# EAGLE board ARM_board (EAGLE 6.5.0), part 1 of 2
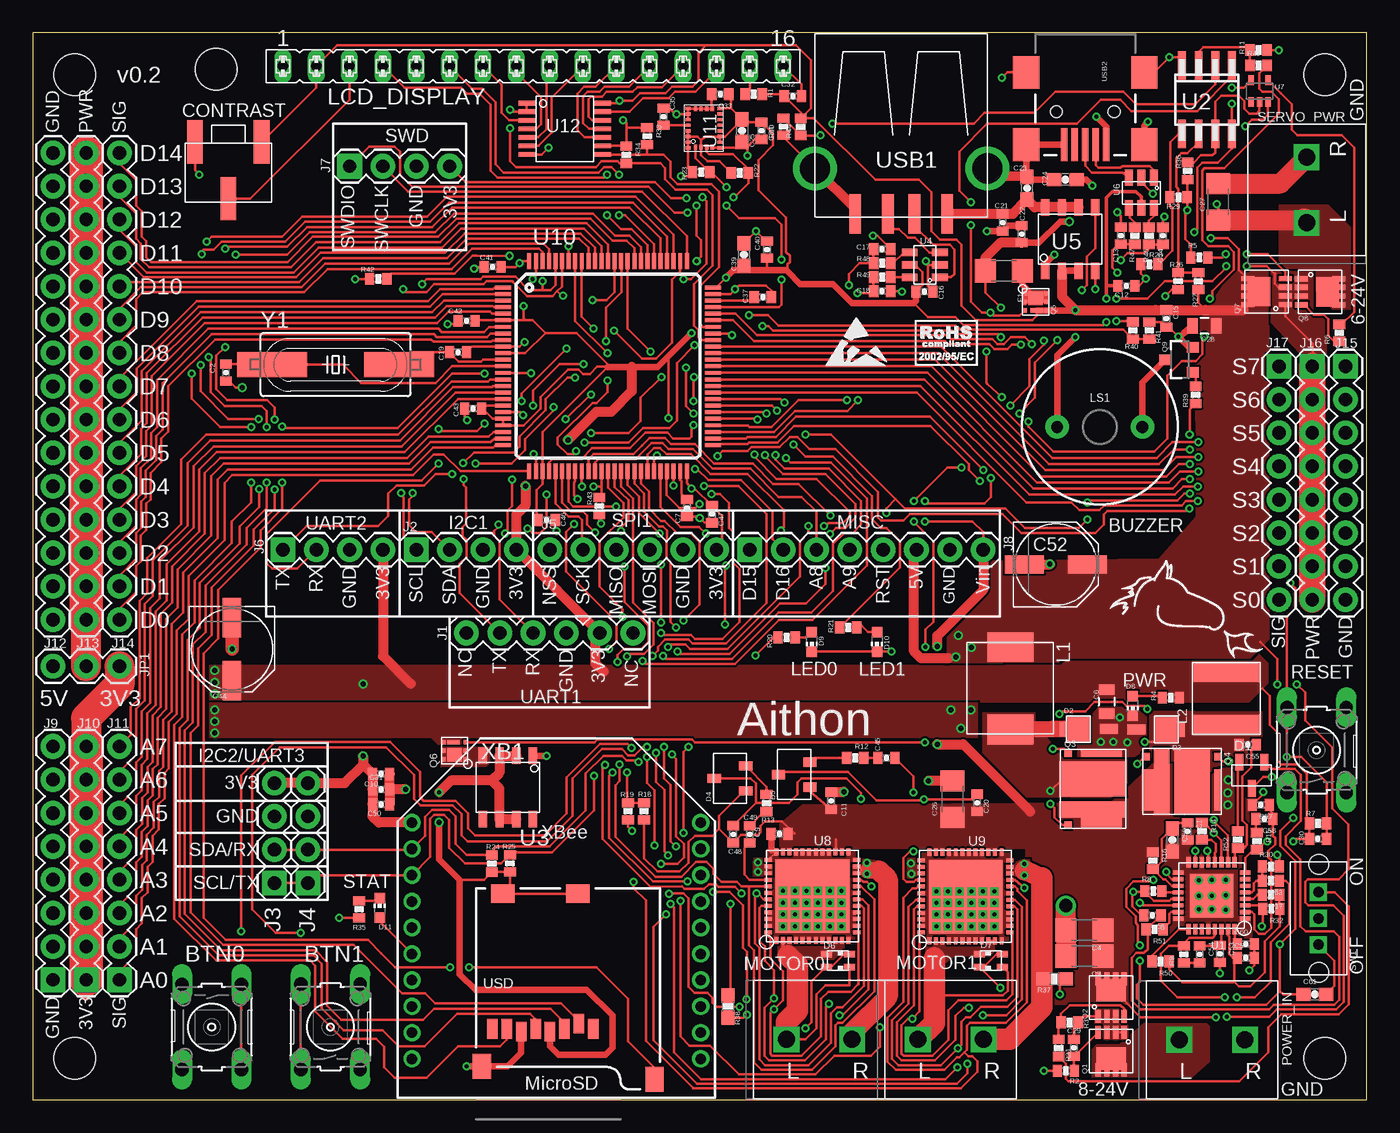
[diagram p1: board, top side]
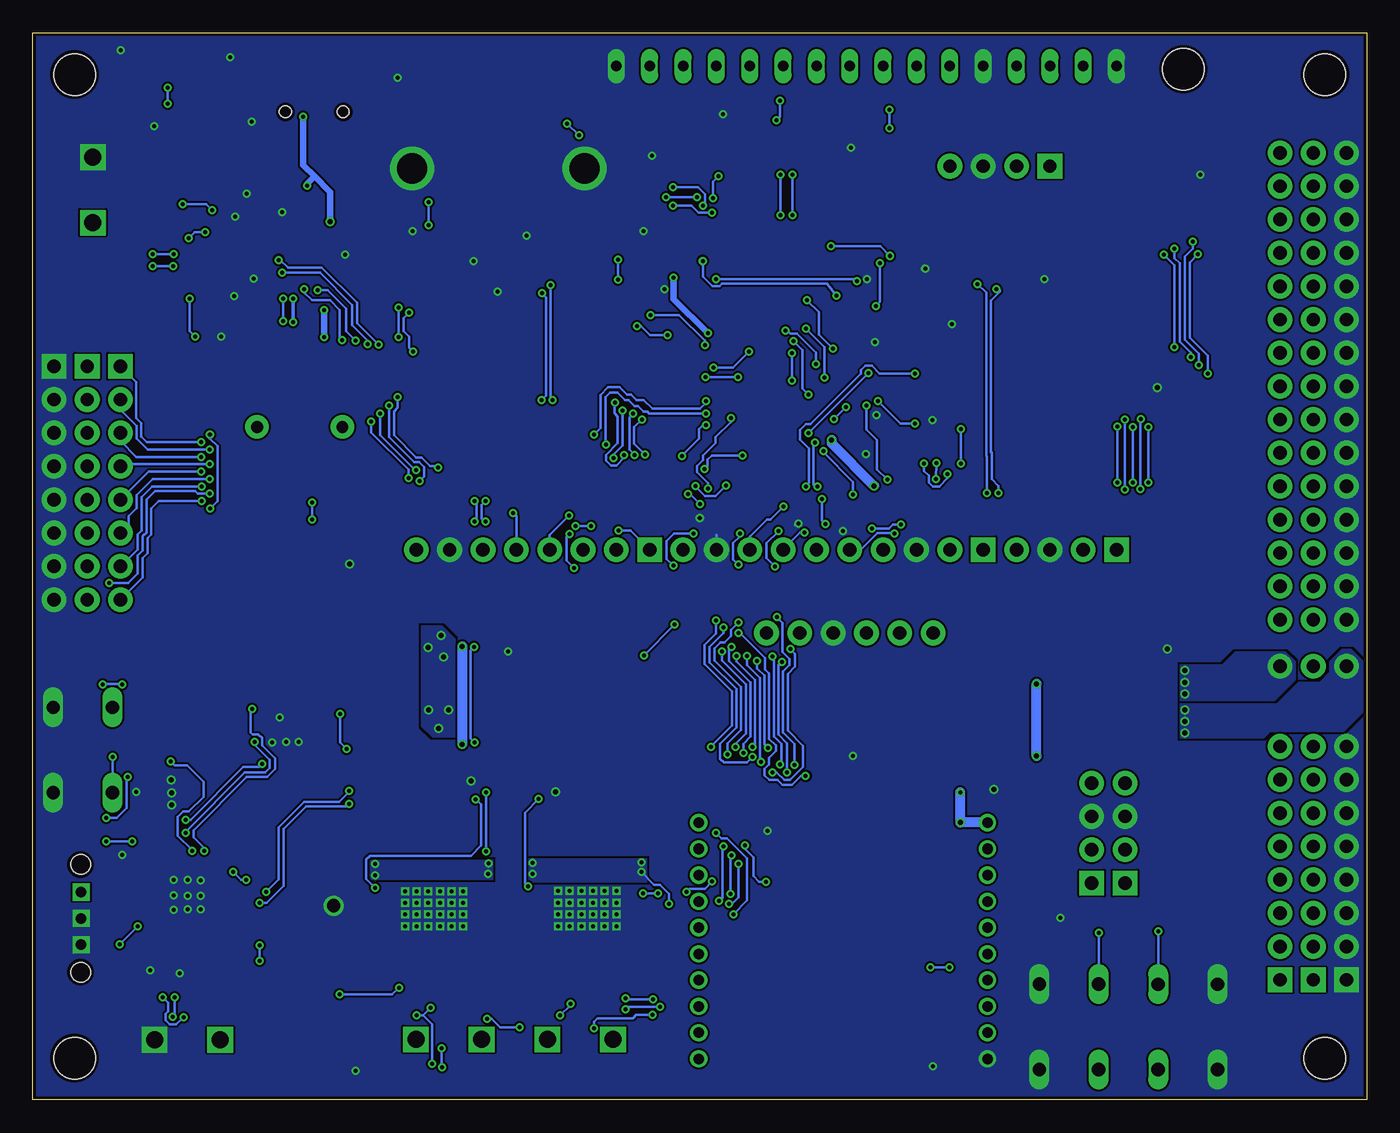
[diagram p2: board, bottom side, seen from below]

Size 101.6 x 81.28 mm. Coordinates in mm from the lower left corner, seen from the top.
Outline: 0,0 101.6,0 101.6,81.28 0,81.28 0,0
Copper layers (1*16): Top 0.035mm / dielectric 1.5mm / Bottom 0.035mm
Design rules "Fusion_eagle_rule_v1.1": minimum track width 6mil, minimum drill 12mil, track to track 6mil, track to pad 6mil, pad to pad 6mil, via to via 6mil, smd to smd 0mil, copper to edge 10mil, drill to drill 10mil, minimum pad ring 10mil, minimum via ring 6mil, stop-mask expansion 2mil, vias tented up to drill 100mil, thermal gap 10mil
Holes 3.17 mm at 98.42,78.11 98.42,3.17 3.17,3.17 13.97,78.51 3.17,78.11
tRestrict: area 95.2,74.9 to 101.6,81.3; area 95.2,0 to 101.6,6.3; area 0,0 to 6.3,6.3; area 10.8,75.3 to 17.1,81.6; area 0,74.9 to 6.3,81.3
vRestrict: area 11.4,45 to 91.4,81.1; 8 lines

## Footprints (pad centres in the part's own frame; a part is rotated, then mirrored left to right if it is on the bottom)
B3F-10XX = drill 1.016 long: 1 -3.251,2.261; 2 3.251,2.261; 3 -3.251,-2.261; 4 3.251,-2.261
0402-CAP = smd 0.7 x 0.9: 1 -0.65,0; 2 0.65,0
1206 = smd 1.6 x 1.8: 1 -1.4,0; 2 1.4,0
0805 = smd 0.8 x 1.2: 1 -0.9,0; 2 0.9,0
0603-CAP = smd 1.1 x 1: 1 -0.85,0; 2 0.85,0
PANASONIC_D = smd 3 x 1.4: + 2.4,0; - -2.4,0
SOT-23 = smd 0.61 x 1.26: P$0 0,-0.995; P$1 0.95,0.995; P$2 -0.95,0.995
STPS1L30M = smd 0.5 x 1.1: C2 -2.07,0 | smd 1.38 x 0.75: P$1 1.397,0 | smd 1.82 x 2.03: P$2 -0.91,0
SOT-23' = smd 0.7 x 1: 1 -0.95,-1.2; 2 0.95,-1.2; 3 0,1.2
LED-0606 = smd 0.85 x 0.5: 1 0.875,0.5; 2 -0.875,0.5; 3 0.875,-0.5; 4 -0.875,-0.5
CHIP-LED0603 = smd 0.8 x 0.8: A 0,-0.75; C 0,0.75
1X06 = drill 1.016 pad 1.88: 1 0,0; 2 2.54,0; 3 5.08,0; 4 7.62,0; 5 10.16,0; 6 12.7,0
1X04 = drill 1.016 pad 1.88 square: 1 0,0 | drill 1.016 pad 1.88: 2 2.54,0; 3 5.08,0; 4 7.62,0
1X08 = drill 1.016 pad 1.88 square: 1 0,0 | drill 1.016 pad 1.88: 2 2.54,0; 3 5.08,0; 4 7.62,0; 5 10.16,0; 6 12.7,0; 7 15.24,0; 8 17.78,0
1X15 = drill 1.016 pad 1.88: 1 0,0; 2 2.54,0; 3 5.08,0; 4 7.62,0; 5 10.16,0; 6 12.7,0; 7 15.24,0; 8 17.78,0; 9 20.32,0; 10 22.86,0; 11 25.4,0; 12 27.94,0; 13 30.48,0; 14 33.02,0; 15 35.56,0
1X03 = drill 1.016 pad 1.88: 1 0,0; 2 2.54,0; 3 5.08,0
INDUCTOR-LMIP707 = smd 2.261 x 3.505: P$1 3.124,0; P$2 -3.124,0
INDUCTOR-0520CDMCDS = smd 1.5 x 5.2: P$1 -2,0; P$2 2,0
LCD = drill 0.8 long: A 16.51,0; DB0 -3.81,0; DB1 -1.27,0; DB2 1.27,0; DB3 3.81,0; DB4 6.35,0; DB5 8.89,0; DB6 11.43,0; DB7 13.97,0; E -6.35,0; K 19.05,0; R/W -8.89,0; RS -11.43,0; VDD -16.51,0; VO -13.97,0; VSS -19.05,0
BUZZER-12MM = drill 0.9 pad 1.778: + 3.25,0; - -3.25,0
2POS_TERMINAL = drill 1.3 square: L -5,0; R 0,0
POT = smd 1.194 x 3.302: 1 -2.54,0; 2 0,4.318; 3 2.54,0
POWERPAK1212-8 = smd 0.991 x 0.406: 1 -1.435,0.991; 2 -1.435,0.33; 3 -1.435,-0.33; 4 -1.435,-0.991; 5 1.435,0.991; 6 1.435,0.33; 7 1.435,-0.33; 8 1.435,-0.991 | smd 1.727 x 2.235: PAD 0.559,0
DUAL-MOSFET-STL60N32N3LL = smd 0.57 x 0.6: 1 -1.905,-2.151; 8 -1.905,3.35 | smd 3.11 x 0.9: 2/3/4 0.635,-2 | smd 3.11 x 0.6: 5/6/7 0.635,3.35 | smd 5.1 x 1.2: D1 0,-0.95 | smd 5.1 x 2.69: S1D2 0,1.37
POWERFLAT = smd 0.35 x 0.3: 1 -0.65,-0.825; 2 0,-0.825; 3 0.65,-0.825; 4 0.65,0.825; 5 0,0.825; 6 -0.65,0.825 | smd 0.35 x 0.95: 7 0.65,0.087 | smd 1.05 x 1.125: 8 -0.3,0
SOT23-3 = smd 0.8 x 0.9: 1 -0.95,-1; 2 0.95,-1; 3 0,1.1
0402-RES = smd 0.7 x 0.9: 1 -0.65,0; 2 0.65,0
0603-RES = smd 1.1 x 1: 1 -0.85,0; 2 0.85,0
SW = drill 0.8 square: P$1 0,0; P$2 2,0; P$3 -2,0 | hole 1.5: -4.1,-0.04; 4.1,-0.04
VFQFPN-32 = smd 0.8 x 0.32: 1 -2.55,1.75; 2 -2.55,1.25; 3 -2.55,0.75; 4 -2.55,0.25; 5 -2.55,-0.25; 6 -2.55,-0.75; 7 -2.55,-1.25; 8 -2.55,-1.75; 17 2.55,-1.75; 18 2.55,-1.25; 19 2.55,-0.75; 20 2.55,-0.25; 21 2.55,0.25; 22 2.55,0.75; 23 2.55,1.25; 24 2.55,1.75 | smd 0.32 x 0.8: 9 -1.75,-2.55; 10 -1.25,-2.55; 11 -0.75,-2.55; 12 -0.25,-2.55; 13 0.25,-2.55; 14 0.75,-2.55; 15 1.25,-2.55; 16 1.75,-2.55; 25 1.75,2.55; 26 1.25,2.55; 27 0.75,2.55; 28 0.25,2.55; 29 -0.25,2.55; 30 -0.75,2.55; 31 -1.25,2.55; 32 -1.75,2.55 | smd 3.3 x 3.3: PAD 0,0
SO08 = smd 0.6 x 2.2: 1 -1.905,-2.6; 2 -0.635,-2.6; 3 0.635,-2.6; 4 1.905,-2.6; 5 1.905,2.6; 6 0.635,2.6; 7 -0.635,2.6; 8 -1.905,2.6
8-SOIC = smd 0.635 x 1.27: 1 -1.27,-1.778; 2 0,-1.778; 3 1.27,-1.778; 4 2.54,-1.778; 5 2.54,3.048; 6 1.27,3.048; 7 0,3.048; 8 -1.27,3.048
SOT23-6L = smd 1.2 x 0.6: P$1 -1.1,0.9; P$2 -1.1,-0.05; P$3 -1.1,-1; P$4 1.2,-1; P$5 1.2,-0.05; P$6 1.2,0.9
SC70 = smd 0.4 x 0.75: 1 -0.65,-0.825; 2 0,-0.825; 3 0.65,-0.825; 4 0.65,0.825; 5 -0.65,0.825
VFQFPN48 = smd 0.55 x 0.3: 1 -3.375,2.75; 2 -3.375,2.25; 3 -3.375,1.75; 4 -3.375,1.25; 5 -3.375,0.75; 6 -3.375,0.25; 7 -3.375,-0.25; 8 -3.375,-0.75; 9 -3.375,-1.25; 10 -3.375,-1.75; 11 -3.375,-2.25; 12 -3.375,-2.75; 25 3.375,-2.75; 26 3.375,-2.25; 27 3.375,-1.75; 28 3.375,-1.25; 29 3.375,-0.75; 30 3.375,-0.25; 31 3.375,0.25; 32 3.375,0.75; 33 3.375,1.25; 34 3.375,1.75; 35 3.375,2.25; 36 3.375,2.75 | smd 0.3 x 0.55: 13 -2.75,-3.375; 14 -2.25,-3.375; 15 -1.75,-3.375; 16 -1.25,-3.375; 17 -0.75,-3.375; 18 -0.25,-3.375; 19 0.25,-3.375; 20 0.75,-3.375; 21 1.25,-3.375; 22 1.75,-3.375; 23 2.25,-3.375; 24 2.75,-3.375; 37 2.75,3.375; 38 2.25,3.375; 39 1.75,3.375; 40 1.25,3.375; 41 0.75,3.375; 42 0.25,3.375; 43 -0.25,3.375; 44 -0.75,3.375; 45 -1.25,3.375; 46 -1.75,3.375; 47 -2.25,3.375; 48 -2.75,3.375 | smd 5.6 x 5.6: PAD 0,0
TQFP100 = smd 1.2 x 0.3: 1 -8,6; 2 -8,5.5; 3 -8,5; 4 -8,4.5; 5 -8,4; 6 -8,3.5; 7 -8,3; 8 -8,2.5; 9 -8,2; 10 -8,1.5; 11 -8,1; 12 -8,0.5; 13 -8,0; 14 -8,-0.5; 15 -8,-1; 16 -8,-1.5; 17 -8,-2; 18 -8,-2.5; 19 -8,-3; 20 -8,-3.5; 21 -8,-4; 22 -8,-4.5; 23 -8,-5; 24 -8,-5.5; 25 -8,-6; 51 8,-6; 52 8,-5.5; 53 8,-5; 54 8,-4.5; 55 8,-4; 56 8,-3.5; 57 8,-3; 58 8,-2.5; 59 8,-2; 60 8,-1.5; 61 8,-1; 62 8,-0.5; 63 8,0; 64 8,0.5; 65 8,1; 66 8,1.5; 67 8,2; 68 8,2.5; 69 8,3; 70 8,3.5; 71 8,4; 72 8,4.5; 73 8,5; 74 8,5.5; 75 8,6 | smd 0.3 x 1.2: 26 -6,-8; 27 -5.5,-8; 28 -5,-8; 29 -4.5,-8; 30 -4,-8; 31 -3.5,-8; 32 -3,-8; 33 -2.5,-8; 34 -2,-8; 35 -1.5,-8; 36 -1,-8; 37 -0.5,-8; 38 0,-8; 39 0.5,-8; 40 1,-8; 41 1.5,-8; 42 2,-8; 43 2.5,-8; 44 3,-8; 45 3.5,-8; 46 4,-8; 47 4.5,-8; 48 5,-8; 49 5.5,-8; 50 6,-8; 76 6,8; 77 5.5,8; 78 5,8; 79 4.5,8; 80 4,8; 81 3.5,8; 82 3,8; 83 2.5,8; 84 2,8; 85 1.5,8; 86 1,8; 87 0.5,8; 88 0,8; 89 -0.5,8; 90 -1,8; 91 -1.5,8; 92 -2,8; 93 -2.5,8; 94 -3,8; 95 -3.5,8; 96 -4,8; 97 -4.5,8; 98 -5,8; 99 -5.5,8; 100 -6,8
LSM330 = smd 0.25 x 0.375: 1 -1.505,1.212; 6 -1.505,-1.212; 7 -1.075,-1.212; 8 -0.645,-1.212; 9 -0.215,-1.212; 10 0.215,-1.212; 11 0.645,-1.212; 12 1.075,-1.212; 13 1.505,-1.212; 18 1.505,1.212; 19 1.075,1.212; 20 0.645,1.212; 21 0.215,1.212; 22 -0.215,1.212; 23 -0.645,1.212; 24 -1.075,1.212 | smd 0.375 x 0.25: 2 -1.462,0.645; 3 -1.462,0.215; 4 -1.462,-0.215; 5 -1.462,-0.645; 14 1.462,-0.645; 15 1.462,-0.215; 16 1.462,0.215; 17 1.462,0.645
TSSOP-14 = smd 1.26 x 0.36: 1 -2.9,1.95; 2 -2.9,1.3; 3 -2.9,0.65; 4 -2.9,0; 5 -2.9,-0.65; 6 -2.9,-1.3; 7 -2.9,-1.95; 8 2.9,-1.95; 9 2.9,-1.3; 10 2.9,-0.65; 11 2.9,0; 12 2.9,0.65; 13 2.9,1.3; 14 2.9,1.95
USB-A-S = smd 3 x 0.9: D+ 3.45,-1; D- 3.45,1; GND 3.45,-3.5; VBUS 3.45,3.5 | drill 2.311: GND@1 0,6.566; GND@2 0,-6.566
USB-MINIB = smd 2.5 x 0.5: D+ 2.5,0; D- 2.5,0.8; GND 2.5,-1.6; ID 2.5,-0.8; VBUS 2.5,1.6 | smd 2.5 x 2: MTN1 -3,4.5; MTN2 2.5,4.5; MTN3 -3,-4.5; MTN4 2.5,-4.5 | hole 0.9: 0,2.2; 0,-2.2
MICRO-SD-SOCKET-PP = smd 0.8 x 1.5: 1 -8.94,10.7; 2 -7.84,10.3; 3 -6.74,10.7; 4 -5.64,10.9; 5 -4.54,10.7; 6 -3.44,10.9; 7 -2.34,10.7; 8 -1.24,10.7 | smd 1.8 x 1.4: CD1 -2.05,0.4; CD2 -7.75,0.4 | smd 1.4 x 1.9: GND1 -13.6,14.55; GND3 -0.45,13.55
XBEE = drill 0.8 pad 1.27: 1 -11,9; 2 -11,7; 3 -11,5; 4 -11,3; 5 -11,1; 6 -11,-1; 7 -11,-3; 8 -11,-5; 9 -11,-7; 10 -11,-9; 11 11,-9; 12 11,-7; 13 11,-5; 14 11,-3; 15 11,-1; 16 11,1; 17 11,3; 18 11,5; 19 11,7; 20 11,9
HC49UP = smd 5.334 x 1.93: 1 -4.826,0; 2 4.826,0

## Placement (x,y rotation side)
BTN0  [B3F-10XX]  13.62,5.55 270 top
BTN1  [B3F-10XX]  22.67,5.55 90 top
C1  0.1u  [0402-CAP]  87.96,20.45 270 top
C2  20p  [0402-CAP]  14.71,55.4 270 top
C3  33u  [1206]  80.1,10.94 180 top
C4  33u  [1206]  80.1,12.92 180 top
C5  1u  [0402-CAP]  92.4,10.81 0 top
C6  33u  [0805]  81.79,30.33 270 top
C7  2.2u  [0402-CAP]  49.83,45.09 270 top
C8  0.1u  [0402-CAP]  85.29,14.06 180 top
C9  0.1u  [0402-CAP]  56.86,20.26 180 top
C10  1u  [0402-CAP]  26.53,24.82 0 top
C11  0.1u  [0402-CAP]  60.81,22.78 90 top
C12  0.1u  [0402-CAP]  83.3,62 0 top
C13  47p  [0402-CAP]  82.88,65.84 90 top
C14  47p  [0402-CAP]  86.08,65.81 90 top
C15  0.1u  [0402-CAP]  86.35,59.52 270 top
C16  0.1u  [0402-CAP]  67.92,61.57 0 top
C17  47p  [0402-CAP]  64.69,64.8 0 top
C18  47p  [0402-CAP]  64.69,61.6 0 top
C19  20p  [0402-CAP]  32.38,56.95 0 top
C20  .22u  [0402-CAP]  71.93,22.63 90 top
C21  0.1u  [0402-CAP]  73.87,66.83 270 top
C22  0.1u  [0402-CAP]  75.31,65.95 270 top
C23  10u  [0603-CAP]  75.73,69.45 90 top
C24  10u  [0603-CAP]  78.65,70.1 0 top
C25  10u  [0603-CAP]  54.03,73.83 270 top
C26  33u  [1206]  70.04,22.9 90 top
C27  33u  [1206]  90.29,68.4 90 top
C28  33u  [0805]  89.24,58.96 180 top
C29  0.1u  [0402-CAP]  79.3,3.96 270 top
C30  10n  [0402-CAP]  97.89,19.89 0 top
C31  0.1u  [0402-CAP]  26.53,23.65 0 top
C32  0.1u  [0402-CAP]  57.89,76.45 0 top
C33  0.1u  [0402-CAP]  52.36,76.6 180 top
C34  0.1u  [0402-CAP]  55.51,73.81 270 top
C35  10n  [0402-CAP]  48.03,74.89 90 top
C37  2.2u  [0402-CAP]  55.6,61.14 0 top
C39  4.7u  [0603-CAP]  54.17,64.38 90 top
C40  0.1u  [0402-CAP]  55.93,64.77 90 top
C41  0.1u  [0402-CAP]  35.03,63.45 180 top
C42  0.1u  [0402-CAP]  33.05,59.33 180 top
C43  0.1u  [0402-CAP]  33.53,52.65 180 top
C44  470u  [PANASONIC_D]  15.17,34.32 270 top
C45  10n  [0402-CAP]  65.02,26.05 0 top
C46  1u  [0402-CAP]  39.14,44.17 0 top
C47  10n  [0402-CAP]  51.74,44.61 270 top
C48  .22u  [0402-CAP]  53.35,20.23 90 top
C49  10n  [0402-CAP]  54.61,20.22 270 top
C50  20p  [0402-CAP]  26.53,22.51 0 top
C52  470u  [PANASONIC_D]  77.92,40.78 0 top
C53  47p  [0402-CAP]  90.42,11.12 270 top
C54  100p  [0402-CAP]  88.87,11.08 270 top
C55  0.1u  [0402-CAP]  92.53,27.05 180 top
C57  47p  [0402-CAP]  93.54,22.46 180 top
C58  100p  [0402-CAP]  93.8,21.4 180 top
C59  4.7u  [0603-CAP]  86.79,19.79 270 top
C60  0.1u  [0402-CAP]  92.4,11.87 0 top
C61  4.7u  [0603-CAP]  97.65,8.03 0 top
D1  BAS70-06FILM  [SOT-23]  92.85,24.72 0 top
D2  STPS1L30M  [STPS1L30M]  80.56,28.24 0 top
D3  STPS1L30M  [STPS1L30M]  85.45,28.2 180 top
D4  BAS70-05FILM  [SOT-23']  53.11,24.49 90 top
D5  BAV99  [SOT-23']  58.01,24.77 90 top
D6  RED/GRN  [LED-0606]  61.32,10.62 180 top
D7  RED/GRN  [LED-0606]  72.97,10.62 0 top
D8  RED  [CHIP-LED0603]  83.78,30 180 top
D9  YELLOW  [CHIP-LED0603]  59.33,34.89 180 top
D10  YELLOW  [CHIP-LED0603]  64.3,34.89 180 top
D11  YELLOW  [CHIP-LED0603]  26.42,14.62 0 top
F1  1A  [1206]  73.97,63.15 180 top
J1  Bluesmirf  [1X06]  33.02,35.56 0 top
J2  I2C1  [1X04]  29.21,41.91 0 top
J3  I2C2/USART3  [1X04]  18.4,16.51 90 top
J4  I2C2/USART3  [1X04]  20.94,16.51 90 top
J5  SPI  [1X06]  52.07,41.91 180 top
J6  USART2  [1X04]  19.05,41.91 0 top
J7  SWD  [1X04]  24.13,71.12 0 top
J8  MISC  [1X08]  54.61,41.91 0 top
J9  AGND  [1X08]  1.52,9.14 90 top
J10  APWR  [1X08]  4.06,9.14 90 top
J11  ANALOG  [1X08]  6.6,9.14 90 top
J12  DGND  [1X15]  1.52,36.58 90 top
J13  DPWR  [1X15]  4.06,36.58 90 top
J14  DIGITAL  [1X15]  6.6,36.58 90 top
J15  SGND  [1X08]  100,55.88 270 top
J16  SPWR  [1X08]  97.46,55.88 270 top
J17  SERVO  [1X08]  94.92,55.88 270 top
JP1  DPWR_SEL  [1X03]  6.6,33.02 180 top
L1  1.5uH  [INDUCTOR-LMIP707]  74.45,31.34 270 top
L2  3.3uH  [INDUCTOR-0520CDMCDS]  90.91,30.58 90 top
LCD  LCD_DISPLAY  [LCD]  38.1,78.74 0 top
LS1  BUZZERPTH  [BUZZER-12MM]  81.27,51.26 180 top
MOTOR0  2POS_TERMINAL  [2POS_TERMINAL]  62.41,4.6 0 top
MOTOR1  2POS_TERMINAL  [2POS_TERMINAL]  72.42,4.6 0 top
POT  10K  [POT]  14.9,72.96 180 top
POWER  2POS_TERMINAL  [2POS_TERMINAL]  92.33,4.57 0 top
Q1  SI7617  [POWERPAK1212-8]  82.14,3.71 270 top
Q2  SI7617  [POWERPAK1212-8]  82.14,7.8 90 top
Q3  DUAL-MOSFET  [DUAL-MOSFET-STL60N32N3LL]  80.75,23.08 0 top
Q4  DUAL-MOSFET  [DUAL-MOSFET-STL60N32N3LL]  86.93,24.25 270 top
Q5  STL4P2UH7  [POWERFLAT]  76.38,60.78 270 top
Q6  STL4P2UH7  [POWERFLAT]  32.13,26.59 90 top
Q7  SI7617  [POWERPAK1212-8]  93.97,61.57 180 top
Q8  SI7617  [POWERPAK1212-8]  98.06,61.56 0 top
Q9  2STR1230  [SOT23-3]  87.37,56.38 90 top
R1  10  [0402-RES]  54.91,76.61 0 top
R2  100k  [0402-RES]  78.69,2.21 180 top
R3  100k  [0402-RES]  78.97,5.89 0 top
R4  220  [0402-RES]  86.68,30.64 0 top
R5  100k  [0402-RES]  88.85,64.16 0 top
R6  100k  [0402-RES]  99.51,58.43 90 top
R7  10k  [0402-RES]  97.89,21.06 180 top
R8  510  [0402-RES]  85.35,15.9 0 top
R9  1k  [0402-RES]  87.67,11.09 90 top
R10  10k  [0402-RES]  57.18,74.12 90 top
R11  10k  [0402-RES]  93.37,79.97 180 top
R12  100  [0402-RES]  62.64,26.05 180 top
R13  100  [0402-RES]  55.89,22.61 90 top
R14  220  [0402-RES]  89.05,20.47 270 top
R15  1k  [0402-RES]  93.24,19.71 270 top
R16  3.9  [0402-RES]  85.31,18.22 270 top
R17  100k  [0402-RES]  94.31,15.62 180 top
R18  93.1k  [0402-RES]  46.56,21.98 90 top
R19  10k  [0402-RES]  45.34,21.98 270 top
R20  220  [0402-RES]  57.42,35.22 180 top
R21  220  [0402-RES]  62.11,35.98 180 top
R22  4.7k  [0402-RES]  53.85,70.61 180 top
R23  4.7k  [0402-RES]  50.91,70.66 180 top
R24  4.7k  [0402-RES]  34.96,18 270 top
R25  4.7k  [0402-RES]  36.34,18.01 270 top
R26  10k  [0402-RES]  87.23,62.36 90 top
R27  39k  [0402-RES]  88.77,62.36 270 top
R28  10k  [0402-RES]  85.05,63.65 180 top
R29  39k  [0402-RES]  87.26,68.75 180 top
R30  100k  [0402-RES]  94.3,17.77 0 top
R31  10k  [0402-RES]  78.13,3.95 270 top
R32  47  [0402-RES]  94.34,14.55 180 top
R33  1k  [0402-RES]  46.79,73.41 270 top
R34  1k  [0402-RES]  45.21,71.98 270 top
R35  220  [0402-RES]  24.85,14.52 90 top
R36  100k  [0402-RES]  87.96,70.75 270 top
R37  3k  [0603-RES]  77.83,9.21 0 top
R38  3k  [0603-RES]  52.96,7.11 270 top
R39  10k  [0402-RES]  88.57,53.7 90 top
R40  93.1k  [0402-RES]  83.79,58.61 270 top
R41  10k  [0402-RES]  85.04,58.6 90 top
R42  10k  [0402-RES]  26.31,62.53 0 top
R43  10k  [0402-RES]  43.15,45.23 90 top
R44  39k  [0402-RES]  58.5,74.11 90 top
R45  39k  [0402-RES]  93.36,78.8 0 top
R46  15  [0402-RES]  85.01,65.81 270 top
R47  15  [0402-RES]  83.95,65.81 270 top
R48  15  [0402-RES]  64.69,63.73 180 top
R49  15  [0402-RES]  64.69,62.67 180 top
R50  100k  [0402-RES]  85.9,10.54 180 top
R51  10  [0402-RES]  85.45,12.99 180 top
R52  10  [0402-RES]  91.78,19.82 90 top
R53  330k  [0402-RES]  94.3,16.69 180 top
RESET  [B3F-10XX]  97.79,26.64 90 top
SERVO_PWR  2POS_TERMINAL  [2POS_TERMINAL]  97.03,71.81 90 top
SW1  SW  [SW]  97.92,13.82 90 top
U1  PM6685  [VFQFPN-32]  89.79,15.55 180 top
U2  LM358DT  [SO08]  89.43,76.17 180 top
U3  LD1117D33TR  [8-SOIC]  36.82,24.43 180 top
U4  USBLC6-2  [SOT23-6L]  68,63.55 180 top
U5  STMPS2171MTR  [8-SOIC]  78.38,64.94 0 top
U6  USBLC6-2  [SOT23-6L]  84.48,69.14 270 top
U7  NC7SZU04  [SC70]  93.43,76.83 0 top
U8  L6206Q  [VFQFPN48]  59.39,15.52 90 top
U9  L6206Q  [VFQFPN48]  71.04,15.49 90 top
U10  STM32F437VI  [TQFP100]  43.81,55.88 0 top
U11  LSM330  [LSM330]  51.12,74.02 90 top
U12  MC74HC164  [TSSOP-14]  40.51,73.96 0 top
USB1  USB-A-S  [USB-A-S]  66.14,70.94 270 top
USB2  USB-MINIB-5PIN  [USB-MINIB]  80.16,75.26 270 top
USD  USD-SOCKETNEW  [MICRO-SD-SOCKET-PP]  33.76,16.1 180 top
XB1  XBEE  [XBEE]  39.88,12.12 0 top
Y1  8MHz  [HC49UP]  23.06,56.01 0 top

## Tracks (layer width: path | path; a pad name or v marks a point on that pad's centre or on a via)
5V  (via drill 0.3, 0.38)
  Top 0.203: Q7.8 Q7.7 93.2,62.43 93.2,61.77 Q7.PAD | 92.41,62.43 Q7.8 | POT.1 21.59,77.11 LCD.VDD 23.19,80.34 51.28,80.34 | R27.2 88.77,60.73 89.33,60.17 | Q7.8 91.87,63.22 91.87,64.8 91.03,65.65 v89.71,65.65 | v88.48,66.08 88.69,66.29 88.69,71.01 89.08,71.4 90.27,71.4 91.34,72.46 U2.8 91.34,74.03 v91.34,75.87 | v91.34,77.11 92.24,77.11 U7.5 | R1.2 57.08,76.61 C32.1 58.5,75.19 R44.2 58.52,74.79 | 51.28,80.34 58.12,80.34 59.28,79.18 59.28,75.54 58.52,74.79 | 58.52,74.79 59.48,74.79 64.17,70.1 67.49,70.1 68.45,69.14 68.45,66.17 69.09,65.53 70.34,65.53 70.73,65.14 70.73,60.49 71.83,59.39 76.13,59.39 76.47,59.73 Q5.7 | v90.93,6.31 94.19,6.31 94.77,6.88 99.3,6.88 99.87,7.46 99.87,14 99.06,14.81 97.15,14.81 96.93,15.04 96.93,16.59 97.13,16.79 99.46,16.79 100.22,17.55 100.22,20.97 98.98,22.2 98.98,26.83 96.93,28.89 96.93,31.01 v96.28,31.66 | C15.1 85.51,60.17 85.5,60.17 | U1.29 90.04,12.53 89.86,12.35 88.08,12.35 87.67,11.94 R9.2 86.53,11.74 85.92,11.12 85.92,9.05 87.17,7.8 v90.79,7.8 | v94.79,31.66 94.79,33.57 93.5,34.87 | U12.14 44.49,75.92 v44.7,76.12 45.68,76.12 46.24,76.68 48.21,76.68 48.7,77.17 50.23,77.17 50.7,77.64 50.7,79.76 51.28,80.34 | 45.21,74.08 R34.1 45.17,72.67 U12.9 | 45.21,74.08 45.21,74.38 v44.96,74.62 | R33.1 45.23,74.06 45.21,74.08
  Top 0.254: Q7.7 Q7.6 Q7.5
  Top 0.508: U5.2 U5.3 | LS1.+ 78.03,56.52 78.03,56.73 v79.41,58.11 | Q5.7 Q5.4 79.36,60.13 v79.4,60.17
  Top 0.762: U5.2 78.38,61.19 v79.4,60.17 85.5,60.17 89.33,60.17 92.23,60.17 | 69.75,33.63 67.66,33.63 67.13,34.16 67.13,41.73 J8.6
  Bottom 0.203: v88.48,66.08 89.28,66.08 v89.71,65.65 | v91.34,77.11 v91.34,75.87 | v91.34,75.87 | v90.79,7.8 90.79,6.45 v90.93,6.31 | v94.79,31.66 94.82,31.68 96.26,31.68 v96.28,31.66 | v44.7,76.12 44.7,74.88 v44.96,74.62
  Bottom 0.508: v79.4,60.17 v79.41,58.11
  other vias: 13.84,29.72 13.84,28.83 13.84,27.94 69.91,29.7 71.47,29.71 70.69,28.31 71.49,34.46 70.3,33.74 70.48,35.37
  pour Top (rank 3, no thermals): 94.16,63.2 94.16,35.08 92.71,33.63 78.41,33.63 78.12,33.31 69.66,33.25 69.67,34.09 69.67,37.47 73.18,41.1 85.8,41.25 88.62,44.45 88.57,58.9 91.44,63.22 94.13,63.22
  pour Top (rank 4, no thermals): 29.48,28.37 32.68,28.36 32.89,27.5 32.59,27.03 31.02,27.03 30.92,27.03 30.4,27.54
  pour Top (rank 4): 13.47,30.26 71.96,30.26 71.96,27.56 13.47,27.56
  pour Bottom (rank 4, no thermals): 14.22,30.25 14.22,27.57 7.84,27.57 7.33,28.07 1.75,28.07 0.25,29.57 0.25,33.39 1.17,34.31 1.89,34.31 2.84,33.36 2.84,32.55 3.58,31.81 7.53,31.81 9.09,30.25
  pour Bottom (rank 4, no thermals): 69.42,27.61 71.12,27.61 71.97,28.46 71.97,36.13 70.47,36.13 69.44,35.1 69.42,35.08
+3V3  (via drill 0.3, 0.38)
  Top 0.203: U4.P$5 67.21,63.6 67.77,63.04 67.77,62.07 C16.1 | 37.52,59.38 U10.6 33.74,59.38 C42.1 | U10.100 37.19,63.88 v37.06,63.75 36.75,63.45 C41.1 | v37.39,60.48 37.39,59.51 37.52,59.38 | U10.75 52.02,61.88 v52.78,62.64 | U10.50 49.81,47 v50.16,46.58 50.38,46.58 C47.1 52.5,44.47 52.5,42.34 J5.1 | 53.87,63.22 54.08,63.42 54.08,63.43 C39.1 | 55.96,63.22 55.93,63.25 C40.1 | U10.19 34.4,52.88 34.24,52.72 34.24,52.65 | 34.24,52.65 35.01,51.88 U10.21 U10.22 37.38,51.38 38.67,52.67 38.67,53.54 40.76,55.63 41.58,55.63 41.9,55.3 42.42,55.3 42.98,55.85 43.79,55.85 43.76,55.83 38.81,50.88 U10.28 38.81,46.89 38.38,46.46 38.38,44.28 C46.1 | U10.11 37.51,56.88 39.04,58.41 | 39.04,58.41 41.41,58.41 43.81,56.01 43.81,55.83 | v48.44,51.94 48.44,56.67 v50.16,58.39 | 91.22,32.26 L2.P$2 | C43.1 34.24,52.65 | 92.39,17.3 U1.8 92.34,18.43 92.95,19.03 R15.2 93.91,19.68 v94.04,19.68 | 57.49,63.11 57.49,63.65 57.66,63.82 57.66,64.31 57.38,64.58 57.38,67.18 55.26,69.31 55.26,71.6 56.37,72.71 56.37,73.6 C34.1 54.24,74.46 C25.1 | U11.7 U11.8 | 50.9,73.09 50.61,73.38 U11.23 | U11.8 51.19,73.38 50.9,73.09 | v81.79,59.26 81.55,59.02 70.89,59.02 70.27,59.64 68.19,59.64 67.12,60.71 | R22.2 52.32,71.49 51.37,71.49 50.9,71.96 U11.3 50.9,73.09 | U11.8 52.73,73.38 C25.1 | 37.52,59.38 38.07,59.38 39.04,58.41 | v96.01,19.69 96.21,19.89 C30.1 R7.2 97.05,21.25 97.05,24.82 96.32,25.55 95.08,25.55 94.78,25.85 94.78,27.97 94.21,28.54 94.21,30.77 93.64,31.33 | U11.23 U11.22 | U11.1 U11.24 U11.23 | U11.1 49.94,72.52 49.96,72.5 | U11.13 53.17,75.53 | 53.17,75.53 C25.1 | v49.38,70.34 49.94,70.34 R23.2 49.91,71.02 U11.1 | J7.4 32.97,69.9 47.4,69.9 48.6,68.7 v49.8,68.7
  Top 0.203: 53.17,75.53 53.17,76.44 C33.1 | USD.CD2 USD.CD1 36.34,16.24 R25.2 34.98,17.36 R24.2 34.36,16.74 32.52,16.74
  Top 0.254: 81.79,62.01 81.79,68.73 82.25,69.19 84.02,69.19 84.43,68.78 U6.P$5 | 81.79,62.01 v81.79,61.04 | 81.79,62.01 82.63,62.01 C12.1
  Top 0.508: v52.78,62.64 53.37,63.22 53.87,63.22 55.96,63.22 57.38,63.22 57.49,63.11 58.45,62.15 60.96,62.15 62.41,60.71 67.12,60.71 67.27,60.85 C16.1 | 43.76,55.83 43.81,55.83 45.62,55.83 47.6,55.83 v50.16,58.39 | USD.4 39.4,4.07 40.04,3.43 43.61,3.43 44.15,3.96 44.15,6.43 42.19,8.38 33.72,8.38 32.52,9.58 32.52,16.74 30.96,18.31 v30.96,21.12
  Top 0.762: J10.1 4.06,7.95 | J6.4 26.67,33.81 28.79,31.69 | J3.4 J4.4 23.75,24.13 25.15,25.52 25.15,25.56 | 45.62,55.83 45.62,53.97 44.04,52.4 42.9,52.4 v40.77,50.27 | v37.52,46.76 37.52,45.26 36.83,44.58 J2.4 J1.5 42.83,35.21 42.83,33.26 43.49,32.59 | U3.7 U3.6 35.55,23.72 34.94,24.32 | U3.2 U3.3 35.55,24.92 35.54,24.92 34.94,24.32 | XB1.1 26.37,21.12 25.88,21.61 C50.1 C31.1 C10.1 25.15,25.56 | v25.15,26.19 25.15,25.56 | 34.94,24.32 31.84,24.32 v30.96,23.43
  Top 2.286: JP1.1 6.6,31.62 4.06,29.08 J10.8
  Top 2.54: J10.1 J10.2 J10.3 J10.4 J10.5 J10.6 J10.7 J10.8
  Bottom 0.203: v37.06,63.75 37.06,60.81 v37.39,60.48 | v48.44,51.94 48.44,51.64 49.61,50.47 49.61,50.03 50.55,49.09 50.55,48.75 51.01,48.3 51.01,47.82 50.16,46.97 v50.16,46.58 | v94.04,19.68 v96.01,19.68 v96.01,19.69 | v49.8,68.7 49.8,69.93 v49.38,70.34
  Bottom 0.254: v81.79,59.26 v81.79,61.04
  Bottom 0.508: v52.78,62.64 52.78,61.01 v50.16,58.39 | 6.6,33.01 JP1.1 | v30.95,21.12 v30.96,21.12
  Bottom 0.762: v40.77,50.27 40.77,50.01 v37.52,46.76 | XB1.1 v30.95,21.12 | v25.15,26.19 v25.15,31.69 | v30.96,21.12 v30.96,23.43
  other vias: 13.84,32.7 13.84,31.81 13.84,30.92
  pour Bottom (rank 3, no thermals): 6.19,34.13 10,34.13 11,33.13 14.22,33.13 14.22,30.43 7,30.43 5.4,32.03 5.4,33.34
  pour Top (rank 5, no thermals): 13.47,30.43 13.47,33.14 75.84,33.14 76.77,34.07 93.28,34.07 94.06,33.29 94.06,31.71 93.56,31.21 93.17,30.82 92.62,30.27 13.47,30.27
ANALOG0
  Top 0.203: J11.1 6.6,9.78 7.87,11.05 7.87,13.01 8.31,13.44 8.31,15.37 8.74,15.8 8.74,17.75 9.12,18.14 9.12,20.12 9.6,20.6 9.6,22.53 10.03,22.96 10.03,24.92 10.36,25.25 10.36,28.8 10.97,29.41 10.97,35.75 11.86,36.64 11.86,39.9 14.61,42.65 14.61,46.99 15.19,47.58 28.96,47.58 30.52,49.14 31.3,49.14 32.56,47.88 U10.26
ANALOG1
  Top 0.203: J11.2 6.6,12.32 7.87,13.59 7.87,15.52 8.33,15.98 8.33,17.91 8.66,18.24 8.66,20.19 9.22,20.75 9.22,22.68 9.63,23.09 9.63,25.07 9.93,25.38 9.93,28.96 10.57,29.59 10.57,36.24 11.46,37.13 11.46,40.16 14.1,42.8 14.1,47.24 14.86,48.01 28.8,48.01 30.48,49.68 35.05,49.68 35.25,49.88 U10.25
ANALOG2
  Top 0.203: J11.3 6.6,14.86 7.87,16.13 7.87,18.09 8.28,18.49 8.28,20.4 8.76,20.88 8.76,22.81 9.14,23.19 9.14,25.2 9.5,25.55 9.5,29.11 10.16,29.77 10.16,36.64 11.02,37.5 11.02,40.41 13.59,42.98 13.59,47.5 14.55,48.46 28.66,48.46 30.28,50.09 34.87,50.09 35.16,50.38 U10.24
ANALOG3
  Top 0.203: J11.4 6.6,17.4 7.87,18.67 7.87,20.57 8.33,21.03 8.33,23.01 8.74,23.42 8.74,25.35 9.12,25.73 9.12,29.29 9.75,29.92 9.75,37.02 10.62,37.88 10.62,40.64 13.11,43.13 13.11,47.75 14.26,48.91 28.51,48.91 30.13,50.52 34.72,50.52 35.08,50.88 U10.23
ANALOG4
  Top 0.203: J11.5 6.6,19.94 7.87,21.21 7.87,23.16 8.28,23.57 8.28,25.53 8.71,25.96 8.71,29.44 9.35,30.07 9.35,37.2 10.19,38.04 10.19,40.82 12.68,43.31 12.68,48.01 14,49.33 28.33,49.33 32.37,53.38 U10.18
ANALOG5
  Top 0.203: J11.6 6.6,22.48 7.87,23.75 7.87,25.7 8.31,26.14 8.31,29.59 8.94,30.23 8.94,37.47 9.68,38.21 9.68,41.05 12.24,43.61 12.24,48.26 13.76,49.77 28.11,49.77 32.21,53.88 U10.17
ANALOG6
  Top 0.203: J11.7 6.6,25.02 7.87,26.29 7.87,29.77 8.53,30.43 8.53,37.78 9.14,38.39 9.14,41.1 11.79,43.74 11.79,48.51 13.49,50.22 27.97,50.22 32.03,54.28 34.98,54.28 35.08,54.38 U10.16
ANALOG7
  Top 0.203: J11.8 7.47,27.79 7.47,29.92 8.13,30.58 8.13,38.02 8.72,38.61 8.72,41.29 11.3,43.87 11.3,48.77 13.21,50.67 27.84,50.67 31.89,54.72 34.68,54.72 34.84,54.88 U10.15
ANALOG8
  Top 0.203: U10.36 42.81,48.55 43.08,48.82 45.92,48.82 47.14,50.03 47.96,50.03 48.42,49.57 50.28,49.57 51.77,48.08 54.66,48.08 56.81,45.93 58.56,45.93 59.69,44.8 J8.3
ANALOG9  (via drill 0.3)
  Top 0.203: U10.35 42.31,48.79 42.72,49.2 45.77,49.2 46.41,49.84 46.41,49.85 46.97,50.41 48.14,50.41 48.61,49.94 50.42,49.94 51.88,48.48 54.84,48.48 56.39,46.93 58.33,46.93 v60.74,44.52
  Bottom 0.203: J8.4 62.23,43.03 v60.74,44.52
BAT_SENSE  (via drill 0.3)
  Top 0.203: v41.22,43.87 40.62,43.26 40.62,40.23 44.04,36.81 44.04,36.62 44.46,36.2 44.46,34.88 v43.9,34.33 | U10.33 41.31,47.12 41.22,47.03 41.22,46.03 v41.48,45.77 | R18.2 R19.1 45.27,22.7 v45.27,24.94
  Bottom 0.203: v41.22,43.87 41.48,44.13 v41.48,45.77 | v45.27,24.94 44.94,24.94 44.35,24.35 43.92,24.35 42.93,25.35 42.93,26.98 44.09,28.14 44.09,32.45 43.55,32.99 43.55,33.98 v43.9,34.33
BOOT1  (via drill 0.3)
  Top 0.203: U10.37 43.31,46.73 | 43.31,46.73 43.31,46.05 R43.2 | 43.31,46.73 v42.7,46.73 v42.7,46.74 | v34.41,55.32 31.95,55.32 27.79,51.16 19.14,51.16 v19,51.3 | v19,47.01 19,45.03 17.35,43.38 17.35,42.06 14.12,38.84 14.12,35.13 13.01,34.01 13.01,13.86 14.7,12.17 25.53,12.17 26.53,11.17 27.59,10.11 v31.8,10.11 | USD.GND1 47.36,2.43 45.34,4.45 45.34,7.7 42.93,10.11 v33.24,10.11
  Bottom 0.203: v42.7,46.74 42.7,46.81 42.49,47.02 42.49,49.61 43.18,50.29 43.18,51.03 42.72,51.49 42.37,51.49 38.53,55.32 38.53,55.58 38.19,55.92 37.7,55.92 37.1,55.32 v34.41,55.32 | v19,51.3 v19,47.01 | v33.24,10.11 v31.8,10.11
BOOT3
  Top 0.203: R52.2 91.78,25.59 D1.P$2
BTN0  (via drill 0.3)
  Top 0.203: U10.57 56.29,52.88 v56.68,52.49 | v57.36,48.9 57.73,48.53 60.8,48.53 63.54,45.79 63.54,40.71 59.38,36.54 56.82,36.54 53.49,33.22 46.62,33.22 v46.43,33.41 | v45.62,26.82 45.31,27.1 43.19,27.1 40.65,24.57 40.65,21.81 39,20.16 33.69,20.16 33.17,20.69 33.17,21.81 32.19,22.78 29.78,22.78 29.51,23.06 29.51,24.99 27.22,27.28 18.47,27.28 15.88,24.7 v15.88,12.84 | BTN0.2 BTN0.1
  Bottom 0.203: BTN0.1 15.88,11.37 v15.88,12.84 | v56.68,52.49 56.68,49.83 57.36,49.15 v57.36,48.9 | v45.62,26.82 45.87,27.07 45.87,32.31 46.43,32.87 v46.43,33.41
BTN1  (via drill 0.3)
  Top 0.203: U10.58 56.96,53.38 v57.24,53.1 | v56.55,49.12 56.55,48.77 57.26,48.07 60.63,48.07 63.09,45.61 63.09,43.82 62.45,43.18 61.8,43.18 60.95,42.33 60.95,38.77 59.32,37.13 56.8,37.13 53.24,33.57 48.23,33.57 v48,33.8 | v46.79,26.89 46.48,26.89 45.85,26.25 45.34,26.25 44.88,26.71 43.37,26.71 41.12,24.47 41.12,21.64 39.17,19.68 33.1,19.68 32.65,20.14 32.65,21.77 31.98,22.43 29.54,22.43 29.03,22.94 29.03,24.74 26.91,26.86 18.81,26.86 16.71,24.77 16.71,14.52 18.5,12.73 v20.41,12.73 | BTN1.1 BTN1.2
  Bottom 0.203: BTN1.2 v20.41,12.73 | v57.24,53.1 57.3,53.04 57.3,52.3 57.05,52.05 57.05,50.01 57.94,49.12 57.94,48.69 57.58,48.32 57.15,48.32 56.55,48.91 v56.55,49.12 | v46.79,26.89 46.58,27.1 46.58,31.98 48,33.4 v48,33.8
BUZZER  (via drill 0.3)
  Top 0.203: 88.38,53.05 R39.1 88.11,52.59 v88.11,50.67 | U10.29 39.34,47.9 39.34,48.56 39.6,48.82 41.78,48.82 42.6,49.63 45.5,49.63 46.68,50.81 48.33,50.81 48.77,50.38 50,50.38 50.16,50.53 50.16,51.21 v50.33,51.39 | v52.15,49.05 52.53,49.43 54.45,49.43 54.73,49.71 56.88,49.71 57.66,50.49 58.24,50.49 59.16,49.55 61.14,49.55 64.39,46.3 64.39,44.35 64.62,44.12 66.33,44.12 66.82,44.62 73.86,44.62 75.32,43.16 80.92,43.16 81.58,43.83 81.58,44.58 81.86,44.86 87.81,44.86 88.01,45.06 v88.1,45.06
  Bottom 0.203: v52.15,49.05 52.15,49.07 50.85,50.37 50.85,51.08 50.54,51.39 v50.33,51.39 | v88.11,50.67 88.11,50.37 87.53,49.78 87.53,45.63 v88.1,45.06
DIGITAL0
  Top 0.203: J14.1 6.6,37.41 7.87,38.68 7.87,40.66 8.23,41.02 8.23,43 8.64,43.41 8.64,45.41 8.97,45.74 8.97,47.75 9.78,48.56 9.78,50.37 10.31,50.9 10.31,54.36 13.88,57.93 30.34,57.93 30.52,57.74 34.91,57.74 35.01,57.85 35.79,57.85 U10.9
DIGITAL1
  Top 0.203: J14.2 6.6,39.95 7.87,41.22 7.87,43.18 8.26,43.56 8.26,45.57 8.61,45.92 8.61,47.93 9.4,48.72 9.4,50.57 9.88,51.05 9.88,54.59 13.63,58.33 30.56,58.33 30.77,58.12 34.61,58.12 34.85,58.36 35.8,58.36 U10.8
DIGITAL2
  Top 0.203: J14.3 6.6,42.49 7.87,43.76 7.87,45.74 8.23,46.1 8.23,48.11 9.02,48.9 9.02,50.8 9.47,51.26 9.47,54.84 13.37,58.73 30.91,58.73 31.15,58.49 34.37,58.49 34.76,58.88 U10.7
DIGITAL3
  Top 0.203: J14.4 6.6,45.03 7.87,46.3 7.87,48.26 8.64,49.02 8.64,50.93 9.07,51.36 9.07,55.12 13.11,59.16 30.79,59.16 31.67,60.05 34.82,60.05 34.99,59.88 U10.5
DIGITAL4
  Top 0.203: J14.5 6.6,47.55 8.26,49.2 8.26,51.1 8.69,51.54 8.69,55.35 12.93,59.59 30.63,59.59 31.52,60.48 35.03,60.48 35.12,60.38 U10.4
DIGITAL5
  Top 0.203: J14.6 6.6,50.06 8.28,51.74 8.28,55.5 12.78,59.99 30.43,59.99 31.31,60.88 U10.3
DIGITAL6
  Top 0.203: J14.7 6.6,52.63 7.9,53.92 7.9,55.7 12.62,60.43 30.28,60.43 31.23,61.38 U10.2
DIGITAL7
  Top 0.203: J14.8 6.6,54.99 12.47,60.86 30.12,60.86 31.01,61.75 35.05,61.75 35.19,61.88 U10.1
DIGITAL8
  Top 0.203: U10.98 38.81,64.59 38.56,64.85 33.45,64.85 31.9,63.3 22.45,63.3 20.68,61.52 8.38,61.52 7.87,61.01 7.87,59 6.6,57.73 J14.9
DIGITAL9
  Top 0.203: U10.97 39.31,64.8 38.89,65.23 33.25,65.23 31.73,63.7 22.28,63.7 20.47,61.9 8.23,61.9 6.6,60.27 J14.10
DIGITAL10
  Top 0.203: U10.91 42.31,64.9 41.6,65.61 33.05,65.61 31.55,64.11 22.1,64.11 20.27,62.28 6.91,62.28 J14.11
DIGITAL11
  Top 0.203: U10.90 42.81,64.91 41.73,65.99 32.89,65.99 31.42,64.52 21.92,64.52 20.07,62.66 8.46,62.66 J14.12
DIGITAL12
  Top 0.203: U10.89 43.31,65.04 41.99,66.37 32.61,66.37 31.17,64.92 21.77,64.92 19.86,63.02 8.69,63.02 7.87,63.83 7.87,64.97 6.6,66.24 J14.13
DIGITAL13
  Top 0.203: J14.14 6.6,68.76 7.87,67.49 7.87,65.58 8.23,65.23 8.23,64.06 8.87,63.42 19.66,63.42 21.57,65.33 31.01,65.33 32.46,66.78 42.16,66.78 43.81,65.13 U10.88
DIGITAL14
  Top 0.203: J14.15 6.6,71.32 7.87,70.05 7.87,68.12 8.31,67.69 8.31,65.73 8.64,65.41 8.64,64.21 9.02,63.83 19.41,63.83 21.31,65.73 30.89,65.73 32.28,67.13 42.49,67.13 44.17,65.46 45.24,65.46 45.81,64.88 U10.84
DIGITAL15  (via drill 0.3)
  Top 0.203: U10.44 46.81,49.15 47.32,49.66 47.78,49.66 48.27,49.18 50.12,49.18 51.63,47.67 54.45,47.67 57.21,44.91 57.21,43.62 v56.98,43.38
  Bottom 0.203: v56.98,43.38 56.08,43.38 J8.1
DIGITAL16  (via drill 0.3)
  Top 0.203: v50.44,48.05 50.46,48.03 50.63,48.03 51.45,47.21 53.93,47.21 56.35,44.8 56.35,42.71 J8.2 | U10.45 47.31,48.85 v47.56,49.1
  Bottom 0.203: v50.44,48.05 50.19,48.3 50.19,48.78 49.87,49.1 v47.56,49.1
GND  (via drill 0.3, 0.38, 1.02)
  Top 0.203: C13.2 82.88,67.31 v82.6,67.61 | U4.P$2 68.33,63.6 v68.02,63.91 68.17,63.75 68.17,62 68.57,61.6 C16.2 | U2.4 87.53,79.43 v86.59,79.42 85.47,78.31 USB2.MTN1 | U12.7 38.74,72.02 v39.27,72.54 | U10.99 38.31,62.77 v38.05,62.51 | C2.2 14.95,54.75 15.44,54.25 v15.95,54.25 | C19.2 33.47,57.38 U10.10 37.09,57.38 v37.44,57.73 | U10.74 53.12,61.38 v53.49,61.75 53.77,62.03 55.85,62.03 56.25,61.63 C37.2 | R42.1 v24.54,62.53 | D9.C D10.C v65.4,34.14 | 94.12,75.86 U7.3 94.08,75.05 93.7,74.67 92.84,74.67 v92.34,74.17 | POT.3 12.36,70.8 v12.69,70.47 | U10.27 38.31,49 v38.12,49.19 | U10.20 37.09,52.38 v37.33,52.14 | R43.1 43.15,44.03 v43.29,43.89 | C14.2 86.08,67.19 v86.17,67.28 | C12.2 84.23,62 v84.79,62.55 84.4,62.95 R28.2 | USB2.MTN3 74.23,78.26 v73.82,77.85 | R11.1 v94.9,79.97 | C18.2 66.16,61.6 v66.21,61.55 | 65.38,64.8 C17.2 64.33,65.81 v63.98,65.81 | U6.P$2 84.43,69.91 v85.31,69.03 | C41.2 33.76,63.45 v33.63,63.32 | v31.6,59.08 32.14,59.08 C42.2 | C43.2 32.88,52.01 v33.1,51.79 | C46.2 39.79,43.42 v39.88,43.33 | C32.2 58.54,77.35 LCD.K | R2.2 v77.01,2.21 | U11.19 U11.18 49.95,75.48 U11.17 U11.16 U11.15 U11.14 51.71,75.53 C33.2 | U11.5 51.8,72.52 U11.6 53.57,72.52 C25.2 | U11.20 U11.19 | U11.19 49.91,75.46 | 54.21,73.16 C25.2 | v54.43,71.91 54.43,72.58 | 54.43,72.58 C25.2 | 53.98,73.02 C25.2 | R10.1 57.18,73.34 USB1.GND@2 | R26.1 86.75,61.71 v86.25,61.21 | 56.25,18.99 56.34,18.89 U8.36 U8.37 | R19.2 45.34,20.8 v45.66,20.48 | C7.2 50.69,44.44 v50.8,44.32 51.16,43.96 C47.2 | v93.72,23.45 93.72,23.29 C57.2 | R30.2 94.95,18.51 v94.8,18.66 | R41.2 85.96,59.25 C15.2 86.52,58.87 v87.25,58.14 | C34.2 55.01,73.16 54.43,72.58 | C60.2 C5.2 93.05,10.23 v92.67,9.85
  Top 0.203: C53.2 v90.42,9.65 | C61.2 99.14,8.68 99.14,10.59 SW1.P$3 | C40.2 55.87,65.42 v55.1,66.19 54.17,65.26 C39.2 | R35.1 v23.34,13.87 | U11.19 49.22,75.1 v49.04,75.09 48.42,75.54 C35.2
  Top 0.508: USB2.MTN2 84.66,74.16 v84.94,74.49 | USB2.GND USB2.MTN4 75.66,70.42 C23.2 75.98,70.1 C24.1 | v77.81,64.39 77.11,63.7 U5.1 | 88.27,59.16 C28.2 87.68,58.42 87.39,58.14 v87.25,58.14 88.06,57.33 Q9.2 | U3.1 v39.14,26.21 | C22.1 74.29,66.6 C21.2 v72.66,66.18 | 56.25,18.99 56.25,20.21 C9.2 | v33.03,2.54 v33.04,2.55 USD.GND3 36.15,2.55 37.2,3.6 USD.6
  Top 0.762: USB1.GND 62.64,67.88 USB1.GND@2 | C23.2 73.3,70.35 USB1.GND@1 | C11.2 60.8,23.45 v61.77,23.46 | C26.2 68.23,24.3 v68.22,24.31 | C52.- 77.45,40.78 v77.48,40.8 | v28.38,23.65 C31.2 | C31.2 C10.2 | C31.2 C50.2
  Top 1.016: C44.- v15.17,34.36
  Top 1.524: C3.2 C4.2 78.67,14.03 v78.69,14.78 | C27.2 95.02,69.8 SERVO_PWR.R
  Bottom 0.203: v12.69,70.47 12.84,70.47 | J5.2 49.53,43.02 | v43.29,43.89 43.46,43.89 43.56,43.79
  other vias: 57.15,13.23 58.04,13.23 58.93,13.23 59.82,13.23 60.71,13.23 61.59,13.23 68.81,14.12 69.7,14.12 70.59,14.12 71.48,14.12 72.36,14.12 73.25,14.12 68.81,14.99 69.7,14.99 70.59,14.99 71.48,14.99 72.36,14.99 73.25,14.99 68.81,15.88 69.7,15.88 70.59,15.88 71.48,15.88 72.36,15.88 73.25,15.88 68.81,13.23 69.7,13.23 70.59,13.23 71.48,13.23 72.36,13.23 73.25,13.23 57.15,14.12 58.04,14.12 58.93,14.12 59.82,14.12 60.71,14.12 61.59,14.12 57.15,15.01 58.04,15.01 58.93,15.01 59.82,15.01 60.71,15.01 61.59,15.01 57.15,15.9 58.04,15.9 58.93,15.9 59.82,15.9 60.71,15.9 61.59,15.9 82.8,29.13 82.32,27.28 83.36,27.23 81.36,27.25 91.06,24.36 91.03,23.39 91.03,22.48 88.8,16.71 89.79,16.76 90.88,16.74 90.88,15.57 89.79,15.52 88.82,15.52 88.82,14.5 89.79,14.5 90.86,14.45
  pour Bottom (rank 5, no thermals): 0,0 101.6,0 101.6,81.28 0,81.28
  pour Top (rank 3, no thermals): 56.01,12.22 55.98,19.1 62.64,19.1 62.66,12.22
  pour Top (rank 3, no thermals): 67.77,12.09 67.77,18.82 74.42,18.85 74.42,12.12
  pour Top (rank 5, no thermals): 81.2,29.91 83.91,29.92 84.81,29.16 84.81,26.72 83.9,26.11 79.6,26.11 79.6,28.07 80.71,29.36
  pour Top (rank 6, no thermals): 90.14,25.45 92.89,25.48 92.84,12.29 91.36,12.27 83.41,12.22 83.41,17.42
I2C1_SCL  (via drill 0.3)
  Top 0.203: 39.95,61.59 39.57,61.21 37.64,61.21 36.58,62.31 36.52,62.36 34.57,62.36 34.34,62.13 30.58,62.13 30,61.54 28.42,61.54 v28.19,61.77 | 39.95,61.59 40.31,61.96 U10.95 | v50.55,68.12 50.55,65.84 50.9,65.48 50.9,64.24 v50.57,63.91 | v40.39,61.27 40.27,61.27 39.95,61.59 | v28.03,46.22 28.03,46.09 28.25,45.87 28.25,42.87 J2.1 | U11.2 50.47,71.75 R23.1 51.7,70.66 v52.85,69.51
  Bottom 0.203: v50.55,68.12 50.42,68.25 50.42,68.99 50.94,69.51 v52.85,69.51 | v50.57,63.91 50.57,62.71 49.84,61.98 49.3,61.98 49.1,62.18 41.12,62.18 v40.39,61.27 | v28.03,46.22 28.03,46.76 28.56,47.29 28.56,49.29 28.63,49.36 28.62,49.37 28.62,60.89 27.94,61.57 27.94,61.68 28.03,61.77 v28.19,61.77
I2C1_SDA  (via drill 0.3)
  Top 0.203: U10.96 39.81,62.06 39.45,61.7 38.84,61.7 | 38.84,61.7 37.77,61.7 36.75,62.71 34.29,62.71 34.09,62.51 30,62.51 v29.64,62.15 | v38.84,62.36 38.84,61.7 | v49.55,62.53 50.14,62.53 51.31,63.7 51.31,68.45 v51,68.76 | v53.38,68.76 53.44,68.76 54.5,69.81 R22.1 54.5,70.89 53.34,72.05 51.49,72.05 51.33,72.21 U11.4 | J2.2 30.39,43.27 29.18,43.27 28.67,43.78 28.67,45.74 28.93,46.01 v28.93,46.22
  Bottom 0.203: v49.55,62.53 39.01,62.53 v38.84,62.36 | v29.64,62.15 28.98,61.49 28.98,49.05 28.93,49 v28.93,46.22 | v51,68.76 v53.38,68.76
I2C2_SCL/USART3_TX  (via drill 0.3)
  Top 0.203: J3.1 J4.1 21.55,17.12 XB1.3 | U10.47 48.31,47.27 48.26,47.22 48.26,46.08 49.25,45.09 50.48,45.09 v50.77,45.37 | XB1.3 | v42.73,24.66 42.73,22.05 39.54,18.86 36.56,18.86 R25.1 35.67,18 32.92,18 31.71,19.21 31.71,21.34 31.34,21.72 30.58,21.72 30.26,21.4 30.26,18.5 XB1.3 | v47.86,35.55 48,35.41 50.15,35.41 50.44,35.12 52.55,35.12 53.84,36.41 53.84,40.44 53.34,40.93 53.34,43.24 53.03,43.54 53.03,45.45 52.34,46.14 v51.69,46.14
  Bottom 0.203: v42.73,24.66 43.09,24.66 43.77,23.98 44.5,23.98 44.88,24.36 45.5,24.36 45.86,24.72 45.86,25.2 45.52,25.54 45.52,26.05 45,26.57 45,26.99 45.52,27.51 45.52,32.47 45.83,32.78 45.83,33.64 47.74,35.55 v47.86,35.55 | v51.69,46.14 51.53,46.14 v50.77,45.37
I2C2_SDA/USART3_RX  (via drill 0.3)
  Top 0.203: J3.2 J4.2 28.81,19.05 XB1.2 29.88,20.12 29.88,21.55 30.41,22.07 31.72,22.07 32.2,21.59 32.2,19.5 33.06,18.65 R24.1 34.96,18.94 35.31,19.29 39.36,19.29 42.12,22.05 42.12,24.87 43.45,26.21 44.86,26.21 45.23,25.84 46.01,25.84 v46.13,25.72 | v48.82,46.79 U10.48 | v51.12,46.75 53.77,46.75 55.88,44.63 55.88,37.84 52.8,34.76 50.25,34.76 49.96,35.05 48.17,35.05 47.62,34.51 47.62,34.24 v47.2,33.81
  Bottom 0.203: v48.82,46.79 49.6,46.01 50.4,46.01 51.12,46.73 v51.12,46.75 | v46.13,25.72 46.23,25.8 46.23,32.14 47.2,33.11 v47.2,33.81
LCD_CLK
  Top 0.203: U10.69 51.05,58.88 50.77,59.16 50.77,61.95 52.27,63.45 52.27,69.16 51.69,69.75 49.12,69.75 48.59,70.28 48.59,71.45 48.03,72.02 46.84,72.02 | U12.8 46.84,72.02 | R33.2 46.79,72.07 46.84,72.02
LCD_DATA  (via drill 0.3)
  Top 0.203: U12.1 U12.2 36.51,75.27 v36.35,75.43 | U10.67 50.96,57.88 50.72,58.12 50.72,58.62 50.37,58.98 50.37,62.15 51.77,63.55 51.77,68.91 51.36,69.32 48.97,69.32 48.16,70.13 48.16,70.97 47.79,71.33 R34.2 44.69,71.33 44.53,71.5 43.33,71.5 42.89,71.06 36.8,71.06 36.35,71.51 v36.35,74.01
  Bottom 0.203: v36.35,75.43 v36.35,74.01
LCD_E  (via drill 0.3)
  Top 0.203: U10.81 47.31,65.18 45.11,67.39 v44.65,67.39 | LCD.E 33.45,77.04 34.23,77.04 35.26,76.01 35.26,71.27 35.84,70.61 43.09,70.61 43.52,71.04 44.09,71.04 v44.65,70.49
  Bottom 0.203: v44.65,67.39 v44.65,70.49
LCD_RS  (via drill 0.3)
  Top 0.203: U10.82 46.81,65.12 45.62,66.32 44.81,66.32 v43.74,67.39 | LCD.RS 28.32,77.09 32.64,77.09 33.07,76.66 34.02,76.66 34.87,75.81 34.87,70.78 35.39,70.26 43.54,70.26 v43.74,70.46
  Bottom 0.203: v43.74,67.39 v43.74,70.46
LDO5  (via drill 0.3)
  Top 0.203: U1.3 93.36,14.8 R32.2 93.69,13.3 v93.61,13.22 | v84.33,10.58 84.33,8.99 84.1,8.76 84.1,7.72 84.58,7.24 93.95,7.24 94.99,8.27 | v84.33,11.76 84.19,11.9 84.19,13.31 84.03,13.47 84.03,13.96 83.29,14.7 83.29,16.07 83.84,16.62 85.23,16.62 v85.35,16.75 | v94.37,24.61 93.73,24.61 D1.P$0 | v96.01,21.5 95.02,20.5 95.02,19.33 96.16,18.19 96.16,13.01 v94.99,11.84 94.99,8.27 | U1.18 86.78,16.8 86.35,17.23 v86.35,17.35 | C61.1 95.23,8.03 94.99,8.27
  Bottom 0.203: v84.33,11.76 v84.33,10.58 | v94.99,11.84 v93.61,13.22 | v96.01,21.5 95.19,21.5 94.46,22.23 94.46,24.53 v94.37,24.61 | v85.35,16.75 85.74,16.75 v86.35,17.35
LED0  (via drill 0.3)
  Top 0.203: U10.46 47.81,45.17 49.33,43.65 50.73,43.65 v51.27,43.14 | v52.73,36.2 52.73,40.62 v52.81,40.7 | R20.2 56.41,35.22 v55.06,33.87
  Bottom 0.203: v51.27,43.14 52.76,43.14 53.32,42.58 53.32,41.21 v52.81,40.7 | v52.73,36.2 v55.06,33.87
LED1  (via drill 0.3)
  Top 0.203: v57.95,49.92 58.84,49 60.94,49 63.93,46 63.93,44.23 64.62,43.55 65.04,43.55 66.03,42.55 66.03,40.56 R21.2 | v50.31,52.29 v50.31,52.28 49.74,52.85 v49.74,55.79 | U10.85 45.31,58.74 v47.05,57.01
  Bottom 0.203: v50.31,52.29 54.67,52.29 54.79,52.41 55.09,52.41 55.51,52.84 55.76,52.84 56.23,53.3 56.49,53.3 57.05,53.87 57.62,53.87 57.97,53.52 57.97,49.95 v57.95,49.92 | v49.74,55.79 48.26,55.79 v47.05,57.01
M0_A  (via drill 0.3)
  Top 0.203: U8.17 63.1,14.77 63.3,14.57 63.3,8.67 61.68,7.05 61.24,7.05 60.78,6.6 60.78,4.33 59.09,2.64 55.77,2.64 55.34,3.07 55.34,11.58 54.99,11.93 54.99,15.6 v55.1,15.71 55.22,15.71 55.66,15.27 U8.43 | U10.38 43.81,46.63 45,45.45 45,44.37 43.17,42.55 43.17,39.1 44.93,37.34 v44.93,36.77 | v53.98,15.71 53.47,16.22 52.22,16.22 52.02,16.42 51.49,16.42 51.12,16.06 49.64,16.08 49.47,16.25 47.05,16.23 43.41,19.87 43.41,25.36 v43.58,25.52
  Bottom 0.203: v53.98,15.71 v55.1,15.71 | v44.93,36.77 44.5,36.34 44.5,34.12 43.97,33.59 43.97,33.12 44.45,32.65 44.45,27.99 43.58,27.12 v43.58,25.52
M0_B  (via drill 0.3)
  Top 0.203: U10.39 44.32,47.87 44.32,46.69 45.36,45.68 45.36,44.15 44.79,43.61 v44.79,43.32 | U8.18 63.19,15.27 63.66,14.8 63.66,8.43 61.65,6.43 v61.42,6.43 | v49.87,16.64 47.23,16.63 43.88,19.97 43.88,24.68 v44.14,24.93 | v45.08,40.64 45.08,37.94 46.91,36.1 46.91,34.91 46.34,34.34 45,34.34 44.55,33.89 v44.55,33.37 | v60.66,7.32 60.43,7.09 60.43,4.6 58.83,3 56.07,3 55.73,3.34 55.73,7 v56.45,7.72 56.46,7.73 56.46,9.88 55.76,10.58 55.76,11.68 55.36,12.08 55.36,14.64 55.49,14.77 U8.44 | v54.37,7.67 54.39,7.69 54.39,11.27 54.08,11.58 54.08,14.81 53.05,15.84 v51.8,15.84
  Bottom 0.203: v45.08,40.64 45.7,41.26 45.7,42.4 44.79,43.31 v44.79,43.32 | v51.8,15.84 51.56,16.08 50.39,16.08 v49.87,16.64 | v60.66,7.32 60.66,7.2 v61.42,6.43 | v54.37,7.67 56.39,7.67 v56.45,7.72 | v44.14,24.93 44.14,27.16 44.81,27.83 44.81,33.11 v44.55,33.37
M0_EN  (via drill 0.3)
  Top 0.203: U8.20 63.09,16.27 64.09,15.27 64.09,8.27 61.66,5.85 61.31,5.85 61.14,5.67 61.14,4.07 59.35,2.29 55.51,2.29 54.95,2.85 54.95,11.38 54.54,11.79 54.54,16.16 54.65,16.27 | U10.40 44.81,46.73 45.73,45.82 45.73,37.87 47.27,36.33 47.27,34.7 46.55,33.98 45.47,33.98 v45.28,33.78 | U8.41 54.65,16.27 | 54.65,16.27 53.96,16.27 53.62,16.61 52.44,16.61 51.84,17.21 51.84,17.58 51.3,18.12 50.52,18.12 49.4,17 47.42,17 44.38,20.04 44.38,23.96 44.7,24.28 v44.7,25.55
  Bottom 0.203: v44.7,25.55 44.58,25.67 44.58,27.09 45.16,27.67 45.16,33.67 v45.28,33.78
M0_FAULT  (via drill 0.3)
  Top 0.203: U8.48 56.06,12.72 56.06,12.42 56.17,12.31 56.17,10.75 57.15,9.77 57.15,7.59 v56.45,6.89 56.17,6.62 56.17,3.49 56.31,3.35 58.55,3.35 60.05,4.86 60.05,7.71 60.59,8.24 62.31,8.24 62.87,8.8 62.87,12.55 62.76,12.66 U8.13 | U10.55 55.15,51.88 v55.21,51.82 | v54.97,49.15 54.97,48.99 56.66,47.3 59.68,47.3 62.24,44.77 62.24,44.46 61.72,43.95 60.62,43.95 v60.25,43.73 | v59.07,43.73 59.07,43.2 58.42,42.55 58.42,39.86 52.91,34.35 50.05,34.35 49.7,34.7 48.61,34.7 v48.4,34.49 | v48.44,15.67 48.5,15.73 49.56,15.73 49.94,15.35 49.94,8.59 50.39,8.15 51.4,8.15 51.78,7.77 51.78,7.37 52.09,7.07 v53.84,7.07 | v47.48,26.42 47.48,24.21 48.1,23.59 48.1,18.91 v48.39,18.62
  Bottom 0.203: v54.97,49.15 v54.97,49.16 55.8,49.98 55.8,51.23 v55.21,51.82 | v60.25,43.73 v59.07,43.73 | v48.44,15.67 48.46,15.69 48.46,18.55 v48.39,18.62 | v53.84,7.07 56.27,7.07 v56.45,6.89 | v47.48,26.42 47.48,27.13 46.94,27.67 46.94,31.81 48.56,33.43 48.56,34.32 v48.4,34.49
M1_A  (via drill 0.3)
  Top 0.203: U9.17 74.76,14.74 74.98,14.52 74.98,7.86 74.22,7.09 72.2,7.09 71.4,6.29 71.09,6.29 70.73,5.93 70.73,4.19 v70.48,3.94 69.18,2.64 65.93,2.64 65.46,3.11 65.46,6.06 66.71,7.32 66.71,14.71 67.25,15.24 U9.43 | U10.41 45.31,46.82 46.17,45.96 46.17,44.7 v47.75,43.12 | v47.87,40.77 47.87,36.37 v47.85,36.35 | v48.58,14.91 48.84,14.65 48.84,3.63 50.89,1.57 69.53,1.57 v70.43,2.48 | v47.86,17.96 49.1,17.96 49.59,18.45 49.59,19.49 49,20.09 49,25.97 v48.69,26.3
  Bottom 0.203: v47.75,43.12 47.75,42.91 48.26,42.4 48.26,41.17 v47.87,40.77 | v48.58,14.91 48.35,14.91 47.86,15.4 v47.86,17.96 | v70.48,3.94 70.48,2.53 v70.43,2.48 | v48.69,26.3 48.69,27.15 47.65,28.19 47.65,31.43 49.68,33.47 49.68,34.38 49.23,34.84 48.9,34.84 48.42,35.32 48.42,35.78 v47.85,36.35
M1_B  (via drill 0.3)
  Top 0.203: U10.43 46.31,46.95 46.93,46.34 46.93,45.03 47.85,44.11 48.13,44.11 49.08,43.16 50.11,43.16 50.79,42.48 50.79,37.74 v49.57,36.52 | U9.18 74.79,15.24 75.35,14.68 75.35,7.64 74.16,6.45 v72.38,6.45 | v71.3,7.01 70.9,7.01 70.29,6.39 70.29,4.57 68.71,3 66.16,3 65.81,3.35 65.81,5.89 67.11,7.18 67.11,14.49 67.36,14.74 U9.44 | v71.18,2.74 71.18,2.01 70.38,1.22 50.61,1.22 47.28,4.55 47.28,13.17 v48.24,14.13 | v49.57,20.33 49.57,26.51 v49.94,26.89
  Bottom 0.203: v72.38,6.45 71.86,6.45 | 71.86,6.45 v71.3,7.01 | 71.86,6.45 71.86,6.42 71.18,5.74 v71.18,2.74 | v49.57,20.33 49.16,19.93 48.72,19.93 47.19,18.4 47.19,15.18 v48.24,14.13 | v49.94,26.89 49.94,26.92 48.36,28.5 48.36,31.11 50.43,33.19 50.43,34.65 49.57,35.52 v49.57,36.52
M1_EN  (via drill 0.3)
  Top 0.203: U9.20 74.81,16.24 74.98,16.07 74.98,15.91 75.7,15.18 75.7,7.44 74.13,5.87 71.37,5.87 71.14,5.64 71.14,3.8 70.95,3.62 | U9.41 67.4,16.24 67.27,16.12 67.02,16.12 66.3,15.4 66.3,7.46 65.1,6.25 65.1,2.92 65.73,2.29 69.43,2.29 70.4,3.25 70.59,3.25 70.95,3.62 | U10.42 45.81,46.93 46.57,46.18 46.57,44.81 47.7,43.68 48.01,43.68 48.32,43.36 48.32,42.6 48.26,42.53 48.26,41.25 48.56,40.95 48.56,36.41 v49,35.98 | 70.95,3.62 71.25,3.32 71.58,3.32 71.96,2.94 71.96,2.15 70.67,0.86 50.3,0.86 50.3,0.91 46.7,4.51 46.7,15.18 45.77,16.11 v45.77,16.62 | v46.79,26.12 46.79,24.13 47.36,23.56 v47.36,19.39
  Bottom 0.203: v47.36,19.39 47.36,19.11 46.72,18.47 46.72,17.04 46.29,16.62 v45.77,16.62 | v46.79,26.12 47.22,25.69 48.97,25.69 49.24,25.96 49.24,27.11 48.01,28.35 48.01,31.28 50.06,33.33 50.06,34.51 49,35.57 v49,35.98
M1_FAULT  (via drill 0.3)
  Top 0.203: U9.48 67.65,12.74 67.55,12.65 67.55,6.73 v67,6.18 66.66,6.18 66.17,5.68 66.17,3.5 66.34,3.35 68.51,3.35 69.74,4.58 69.74,6.8 70.5,7.57 74.16,7.57 74.62,8.04 74.62,12.54 U9.13 | U10.56 55.76,52.38 v55.88,52.26 | v55.77,49.13 55.77,49.03 57.14,47.66 60.38,47.66 62.66,45.38 62.66,44.34 61.89,43.57 61.19,43.57 v60.71,43.1 | v60.38,40.49 60.38,39.29 58.9,37.81 56.91,37.81 53.06,33.95 49.31,33.95 v49.12,34.14 | v49.33,15.16 49.33,4.83 50.03,4.13 51.59,4.13 53.78,1.93 59.62,1.93 61.04,3.35 63.83,3.35 64.53,4.06 v64.53,5.53 | v48.09,26.9 48.09,24.47 48.58,23.97 48.58,19.7 v48.98,19.3
  Bottom 0.203: v55.88,52.26 56.15,51.99 56.15,49.52 v55.77,49.13 | v60.71,43.1 60.95,42.86 60.95,41.06 v60.38,40.49 | v67,6.18 66.65,6.18 66,5.53 v64.53,5.53 | v49.33,15.16 49.05,15.4 49.05,19.23 v48.98,19.3 | v48.09,26.9 48.09,27.12 47.3,27.91 47.3,31.62 49.12,33.45 v49.12,34.14
N$1
  pour Top (rank 3, no thermals): 84.66,5.87 89.38,5.84 89.61,5.61 89.61,2.9 88.29,1.73 80.72,1.68 80.72,3.86 81.05,4.24 82.8,4.24
N$2
  Top 0.203: Q1.4 79.32,3.31 C29.2 79.3,2.25 R2.1
N$3  (via drill 0.3)
  Top 0.203: U10.94 40.81,65 v40.79,65.02 | R42.2 27.17,62.81 27.18,62.81 27.3,62.94 32.13,62.94 33.5,64.31 33.81,64.31 v36.3,64.29
  Bottom 0.203: v40.79,65.02 37.03,65.02 v36.3,64.29
N$4
  Top 0.203: U10.73 54.69,60.88 C37.1
N$5
  Top 0.203: U2.3 88.8,79.85 89.14,80.19 92.49,80.19 R11.2 R45.1
N$6
  Top 0.203: U6.P$6 85.46,67.4 85.01,66.95 R46.1
N$7
  Top 0.203: U1.32 91.54,12.08 C60.1
N$8
  Top 0.203: USB2.D+ 80.16,71.17 80.67,70.64 83.03,70.64 U6.P$3
N$9
  Top 0.203: D8.A 85.92,30.75 R4.1
N$10
  Top 0.203: R31.2 78.69,2.74 78.69,1.6 78.89,1.4 91.89,1.4 94.1,3.61 94.1,5.52 95.1,6.53 99.48,6.53 100.23,7.27 100.23,14.75 99.16,15.82 SW1.P$2
N$11
  Top 0.203: U11.21 48.34,74.24 C35.1
N$12
  Top 0.203: U2.5 87.26,73.58 86.64,72.95 86.64,68.78 R29.2 86.61,68.15 86.81,67.95 86.81,64.68 85.79,63.65 R28.1
N$13
  Top 0.203: USB1.D+ 65.14,66.33 65.98,66.33 66.65,65.66 67.18,65.66 68.29,64.55 U4.P$3
N$14  (via drill 0.3)
  Top 0.203: U2.1 91.34,77.97 88.68,75.31 83.69,75.31 82.82,76.18 81.36,76.18 79.54,74.36 72.68,74.36 70.56,72.24 70.56,69.27 v71.44,68.38 | Q5.3 75.15,59.75 73.15,59.75 v72.94,59.96 72.3,59.96 71.44,60.81 v71.44,66.62 | v73.81,53.55 72.71,54.54 72.62,54.63 v72.62,57 | v68,34.49 68,35.81 68.59,36.4 68.59,42.54 67.11,44.02 v67.11,44.04 | v70.73,48.15 69.65,48.15 v67.11,45.61 | v67.94,27.23 50.44,27.24 50.22,27.46 43,27.46 42.78,27.24 Q6.3
  Bottom 0.203: v71.44,68.38 v71.44,66.62 | v73.81,53.55 73.81,52.73 74.1,52.44 74.1,50.63 72.39,48.92 72,48.92 71.34,48.27 70.84,48.27 v70.73,48.15 | v72.94,59.96 73.35,59.55 73.35,58.55 72.92,58.13 72.92,57.3 v72.62,57 | v67.94,27.23 68.24,27.54 68.24,34.25 v68,34.49 | v67.11,44.04 67.17,44.04 67.41,44.28 67.41,45.31 v67.11,45.61
N$15
  Top 0.203: R17.1 94.96,14.58 R32.1 94.99,13.22 93.83,12.06 93.83,9.73 92.73,8.64 91.85,8.64 91.5,8.99 | U1.31 91.04,12.54 91.14,12.45 91.14,11.1 91.42,10.81 C5.1 91.5,10.57 91.5,8.99 | 91.5,8.99 91.45,8.93 87.57,8.93 86.55,9.95 R50.1
N$16
  Top 0.203: U4.P$1 69.94,62.65 70.21,62.92 70.21,64.77 69.85,65.13 68.58,65.13 67.14,66.56 USB1.D-
N$17
  Top 0.203: USB2.D- 80.96,71.21 81.18,70.99 82.86,70.99 82.98,71.12 85.09,71.12 85.38,70.83 U6.P$1
N$18
  Top 0.203: R35.2 26.21,15.17 D11.C
N$19
  Top 2.286: JP1.2 J13.1
  Top 2.54: J13.1 J13.2 J13.3 J13.4 J13.5 J13.6 J13.7 J13.8 J13.9 J13.10 J13.11 J13.12 J13.13 J13.14 J13.15
N$20
  Top 0.203: U1.23 86.73,14.3 86.58,14.15 86.58,13.48 86.14,13.04 86.14,12.99 R51.1
N$21
  Top 0.508: 74.67,67.49 73.89,67.49 C21.1
  Top 0.762: U5.6 U5.7 U5.8 76.3,67.98 C23.1 74.67,67.49 USB1.VBUS
N$22
  pour Top (rank 3, no thermals): 31.08,25.34 31.08,26.89 33.15,26.9 33.53,26.9 34.81,26.9 34.8,25.68 34.47,25.34
N$23
  Top 0.203: Q1.1 82.77,5.14 | C29.1 79.3,5.57 R3.2 80.09,6.36 Q2.1
  pour Top (rank 2, no thermals): 82.68,7.06 81.05,7.09 80.85,6.86 80.85,5.79 80.87,5.69 81.28,5.69 81.31,4.75 81.48,4.6 83.36,4.6 83.46,4.78 83.46,5.64 83.29,5.71 82.85,5.84 82.8,5.87 82.78,6.96
N$24
  Top 0.203: U10.49 49.31,47.23 49.4,47.14 49.4,46.17 C7.1
N$25
  Top 0.203: C8.1 84.83,12.99 R51.2 84.91,12.88 84.91,11.46 84.63,11.18 84.07,11.18 83.71,10.83 83.71,7.55 84.38,6.88 94.18,6.88 94.53,7.24 99.15,7.24 99.52,7.61 99.52,12.41 99.11,12.82 96.94,12.82 96.54,13.23 96.54,18.32 95.42,19.44 95.42,20.09 96.57,21.23 96.57,24.75 96.13,25.19 94.32,25.19 D1.P$1
N$26
  Top 0.203: U2.6 88.8,72.93 87.96,72.09 87.47,72.09 87.09,71.71 87.09,69.56 87.26,69.38 87.26,63.04 R26.2 R27.1
N$27
  Top 0.203: U7.2 93.43,75.33 93.22,75.11 92.67,75.11 92.29,75.49 92.29,76.06 91.87,76.48 90.53,76.48 90.07,76.02 U2.7 90.07,72.16 89.85,71.94 88.96,71.94 88.42,71.4 R36.1
N$28
  Top 0.508: LS1.- 84.52,54.64 Q9.3
N$29
  Top 0.203: D11.A 26.42,13.58 XB1.6
N$30
  Top 0.203: U7.4 95.07,76.67 95.08,76.67 95.9,75.85 95.9,73.88 96.3,73.48 99.7,73.48 100.64,72.54 100.64,60 99.71,59.08 R6.2
N$31
  Top 0.203: LCD.VO 24.13,76.2 16.57,68.64 POT.2
N$32
  Top 0.381: 76.91,61.08 Q5.5 77.21,61.39 Q5.6
  Top 0.508: Q5.1 Q5.2 75.86,61.08 Q5.8 | Q5.8 76.91,61.08 | 77.21,61.39 76.8,61.39 76.59,61.19 | F1.1 75.37,62.09 Q5.8 | Q5.6 75.75,61.43 75.73,61.4
N$33